# Altium schematic sheet Power.SchDoc
size A; SheetNumber: 1; SheetTotal: 3
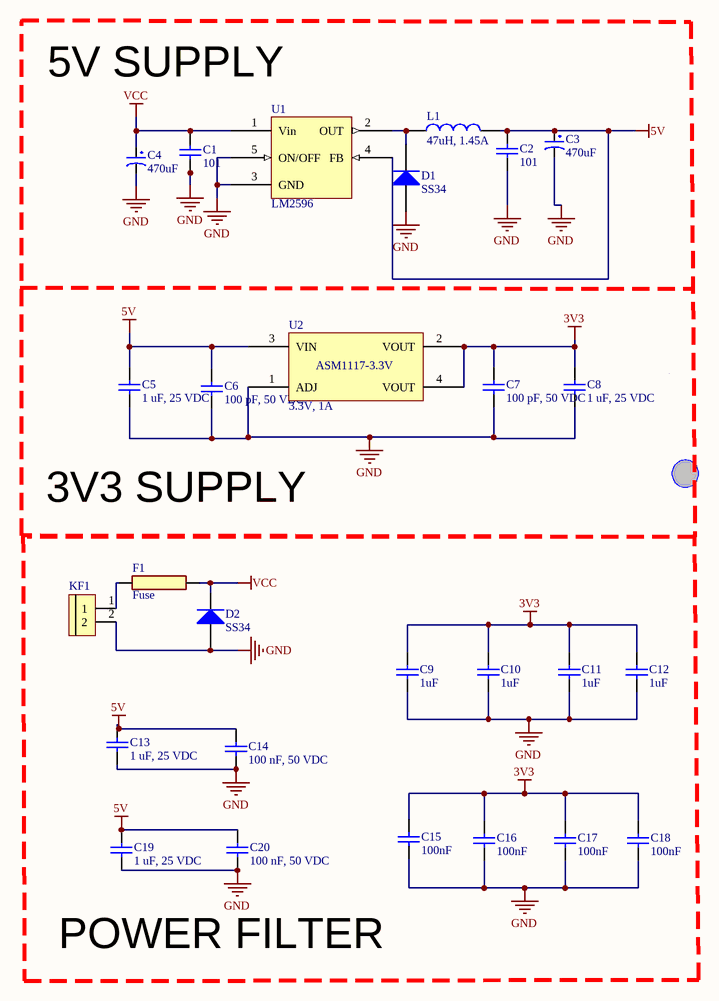
[diagram p0: Power.SchDoc]

## Parts
C1  101  [tu 0805]
C2  101  [tu 0805]
C3  470uF  [tu hoa 8mm]
C4  470uF  [tu hoa 8mm]
C5  1 uF, 25 VDC  [CAP_0603]
C6  100 pF, 50 VDC  [CAP_0603]
C7  100 pF, 50 VDC  [CAP_0603]
C8  1 uF, 25 VDC  [CAP_0603]
C9  1uF  [CAP_0805]
C10  1uF  [CAP_0805]
C11  1uF  [CAP_0805]
C12  1uF  [CAP_0805]
C13  1 uF, 25 VDC  [CAP_0805]
C14  100 nF, 50 VDC  [CAP_0805]
C15  100nF  [CAP_0603]
C16  100nF  [CAP_0603]
C17  100nF  [CAP_0603]
C18  100nF  [CAP_0603]
C19  1 uF, 25 VDC  [CAP_0805]
C20  100 nF, 50 VDC  [CAP_0805]
D1  SS34  [DIODE SMA]
D2  SS34  [DIODE SMA]
F1  Fuse  [FUSE]
KF1  CON 2 KF7.62  [CON 2 KF7.62]  (value not drawn)
L1  47uH, 1.45A  [WE-PD2A_1054]
U1  LM2596  [LM2596_Library]
U2  3.3V, 1A  [AMS1117-3.3V SOT223]

## Nets
3V3: C7.2 C8.2 C9.2 C10.2 C11.2 C12.2 C15.2 C16.2 C17.2 C18.2 U2.2(VOUT) U2.4(VOUT)
5V: C2.1 C3.1 C5.2 C6.2 C13.2 C14.2 C19.2 C20.2 L1.2 U1.4(FB) U2.3(VIN)
GND: C1.2 C2.2 C3.2 C4.2 C5.1 C6.1 C7.1 C8.1 C9.1 C10.1 C11.1 C12.1 C13.1 C14.1 C15.1 C16.1 C17.1 C18.1 C19.1 C20.1 D1.1(A) D2.1(A) KF1.2 U1.3(GND) U1.5(ON/OFF) U2.1(ADJ)
VCC: C1.1 C4.1 D2.2(K) F1.51 U1.1(Vin)
NetD1_2: D1.2(K) L1.1 U1.2(OUT)
NetF1_?1: F1.?1(FUSE) KF1.1

## Notes on the sheet
- 5V SUPPLY
- 3V3 SUPPLY
- POWER FILTER
- (in symbol AMS1117-3.3V) ASM1117-3.3V

## Library data of the parts
C1 C2 = Tu 0805 101 50V 20%: Dán; Don_Vi: Con; So_Chan: 2; Ten_Linh_Kien: Tụ 0805 101-0.1nF 50V 20%; Ma_Hang: MH002806; Chung_Loai: Dán; Kieu_Chan: *
C3 C4 = Tu Hoa 470uF 25V 8x13: Cắm; Don_Vi: Con; So_Chan: 2; Ten_Linh_Kien: Tụ Hóa 470uF 25V; Ma_Hang: MH 470uF 25V; Chung_Loai: Cắm; Kieu_Chan: *
C5 C8 = 0106031051025: CAP, size 0603, 1 uF, 25 VDC; Manufacture Name: Samsung Electro-Mechanics; Manufacture SN: CL10A105KA8NNNC; Capacitance: 1 uF; Tolerance: +/-10%; Voltage Rating DC: 25 VDC; ComponentLink2Description: Datasheet; ComponentLink2URL: https://www.mouser.vn/datasheet/2/585/MLCC-1837944.pdf; Operating Temperature: -55 to +125degC; Packaging: Tape and Reel; Mounting Technology: SMT; Size: 0603; Supplier 1 Name: Mouser; Supplier 1 SN: 187-CL10A105KA8NNNC; Supplier 1 URL: https://www.mouser.vn/ProductDetail/Samsung-Electro-Mechanics/CL10A105KA8NNNC?qs=hqM3L16%252BxldY%252BnK4KzDJVg%3D%3D&utm_source=mouser-refine-download&utm_medium=file&utm_campaign=CL10A105KA8NNNC&utm_content=Samsung-Electro-Mechanics; Supplier 2 Name: Digi-Key; Supplier 2 SN: 1276-1102-2-ND; Supplier 2 URL: https://www.digikey.com/en/products/detail/samsung-electro-mechanics/cl10a105ka8nnnc/3886760; Supplier 3 Name: thegioiic; Supplier 3 SN: N/A; Supplier 3 URL: N/A; Value: 1 uF, 25 VDC
C6 C7 = 0106031010550: CAP, size 0603, 100 pF, 50 VDC; Manufacture Name: TDK; Manufacture SN: CGA3E2C0G1H101J080AA; Capacitance: 100 pF; Tolerance: +/-5%; Voltage Rating DC: 50 VDC; ComponentLink2Description: Datasheet; ComponentLink2URL: https://product.tdk.com/system/files/dam/doc/product/capacitor/ceramic/mlcc/catalog/mlcc_automotive_general_en.pdf?ref_disty=mouser; Operating Temperature: -55 to +125degC; Packaging: Tape and Reel; Mounting Technology: SMT; Size: 0603; Supplier 1 Name: Mouser; Supplier 1 SN: 810-CGA3E2C0G1H101J; Supplier 1 URL: https://www.mouser.com/ProductDetail/TDK/CGA3E2C0G1H101J080AA?qs=FxQuwy19cyBF0gUakpLdHA%3D%3D&utm_source=mouser-refine-download&utm_medium=file&utm_campaign=CGA3E2C0G1H101J080AA&utm_content=TDK; Supplier 2 Name: Digi-Key; Supplier 2 SN: 445-5640-2-ND; Supplier 2 URL: https://www.digikey.com/en/products/detail/tdk-corporation/cga3e2c0g1h101j080aa/2443118; Supplier 3 Name: thegioiic; Supplier 3 SN: N/A; Supplier 3 URL: N/A; Value: 100 pF, 50 VDC
C9-C12 = 0108051051025: CAP, size 0805, 1 uF, 25 VDC; Manufacture Name: TDK; Manufacture SN: CGA4J1X8R1E105K125AE; Tolerance: +/-10%; Voltage Rating DC: 25 VDC; ComponentLink2Description: Datasheet; ComponentLink2URL: https://product.tdk.com/system/files/dam/doc/product/capacitor/ceramic/mlcc/catalog/mlcc_automotive_soft_en.pdf?ref_disty=mouser; Operating Temperature: -55 to +125degC; Packaging: Tape and Reel; Mounting Technology: SMT; Size: 0805; Capacitance: 1 uF; Supplier 1 Name: Mouser; Supplier 1 SN: 810-A4J1X815K125AE; Supplier 1 URL: https://www.mouser.vn/ProductDetail/TDK/CGA4J1X8R1E105K125AE?qs=Ii670aiJhr6VRhkBsruYJg%3D%3D&utm_source=mouser-refine-download&utm_medium=file&utm_campaign=CGA4J1X8R1E105K125AE&utm_content=TDK; Supplier 2 Name: Digi-Key; Supplier 2 SN: 445-174807-2-ND; Supplier 2 URL: https://www.digikey.com/en/products/detail/tdk-corporation/cga4j1x8r1e105k125ae/6556490; Supplier 3 Name: thegioiic; Supplier 3 SN: OEM; Supplier 3 URL: N/A; Value: 1 uF, 25 VDC
C13 C19 = 0108051051025: CAP, size 0805, 1 uF, 25 VDC; Manufacture Name: TDK; Manufacture SN: CGA4J1X8R1E105K125AE; Capacitance: 1 uF; Tolerance: +/-10%; Voltage Rating DC: 25 VDC; ComponentLink2Description: Datasheet; ComponentLink2URL: https://product.tdk.com/system/files/dam/doc/product/capacitor/ceramic/mlcc/catalog/mlcc_automotive_soft_en.pdf?ref_disty=mouser; Operating Temperature: -55 to +125degC; Packaging: Tape and Reel; Mounting Technology: SMT; Size: 0805; Supplier 1 Name: Mouser; Supplier 1 SN: 810-A4J1X815K125AE; Supplier 1 URL: https://www.mouser.vn/ProductDetail/TDK/CGA4J1X8R1E105K125AE?qs=Ii670aiJhr6VRhkBsruYJg%3D%3D&utm_source=mouser-refine-download&utm_medium=file&utm_campaign=CGA4J1X8R1E105K125AE&utm_content=TDK; Supplier 2 Name: Digi-Key; Supplier 2 SN: 445-174807-2-ND; Supplier 2 URL: https://www.digikey.com/en/products/detail/tdk-corporation/cga4j1x8r1e105k125ae/6556490; Supplier 3 Name: thegioiic; Supplier 3 SN: OEM; Supplier 3 URL: N/A; Value: 1 uF, 25 VDC
C14 C20 = 0108051041050: CAP, size 0805, 100 nF, 50 VDC; Manufacture Name: TDK; Manufacture SN: CGA4J2X8R1H104K125AD; Capacitance: 0.1 nF; Tolerance: +/-10%; Voltage Rating DC: 50 VDC; Value: 0.1 nF, 50 VDC; ComponentLink2Description: Datasheet; ComponentLink2URL: https://product.tdk.com/system/files/dam/doc/product/capacitor/ceramic/mlcc/catalog/mlcc_automotive_epoxy_en.pdf?ref_disty=mouser; Operating Temperature: -55 to +125degC; Packaging: Tape and Reel; Mounting Technology: SMT; Size: 0805; Supplier 1 Name: Mouser; Supplier 1 SN: 810-C2012X8R1H104KEP; Supplier 1 URL: https://www.mouser.vn/ProductDetail/TDK/CGA4J2X8R1H104K125AD?qs=LcTL%2F5vFEzExqZqv3rh1qQ%3D%3D&utm_source=mouser-refine-download&utm_medium=file&utm_campaign=CGA4J2X8R1H104K125AD&utm_content=TDK; Supplier 2 Name: Digi-Key; Supplier 2 SN: 445-8810-2-ND; Supplier 2 URL: https://www.digikey.com/en/products/detail/tdk-corporation/cga4j2x8r1h104k125ad/3248169; Supplier 3 Name: thegioiic; Supplier 3 SN: OEM; Supplier 3 URL: N/A
C15-C18 = 0106031041050: CAP, size 0603, 100 nF, 50 VDC; Manufacture Name: TDK; Manufacture SN: CGA3E3X8R1H104K080AE; Tolerance: +/-10%; Voltage Rating DC: 50 VDC; ComponentLink2Description: Datasheet; ComponentLink2URL: https://product.tdk.com/system/files/dam/doc/product/capacitor/ceramic/mlcc/catalog/mlcc_automotive_soft_en.pdf?ref_disty=mouser; Operating Temperature: -55 to +125degC; Packaging: Tape and Reel; Mounting Technology: SMT; Size: 0603; Capacitance: 100 nF; Supplier 1 Name: Mouser; Supplier 1 SN: 810-CGA3E3X8R1H104KA; Supplier 1 URL: https://www.mouser.com/ProductDetail/TDK/CGA3E3X8R1H104K080AE?qs=nQSIdc08i%252Bd8g3IRRgU2bw%3D%3D&utm_source=mouser-refine-download&utm_medium=file&utm_campaign=CGA3E3X8R1H104K080AE&utm_content=TDK; Supplier 2 Name: Digi-Key; Supplier 2 SN: 445-173697-2-ND; Supplier 2 URL: https://www.digikey.com/en/products/detail/tdk-corporation/cga3e3x8r1h104k080ae/5809262; Supplier 3 Name: thegioiic; Supplier 3 SN: N/A; Supplier 3 URL: N/A; Value: 100 nF, 50 VDC
D1 D2 = Diode SS34 ( 1N5822 ): Dán; Don_Vi: Con; Ma_Hang: MH002104; Ten_Linh_Kien: Diode SS34 3A 40V SMA ( 1N5822 SS34A); Kieu_Chan: *; Chung_Loai: Dán
KF1 = CON 2 KF7.62: Cắm; Ma_Hang: MH002053; Ten_Linh_Kien: CON 2 KF7.62-2P 7.62MM (Đen Thẳng); Chung_Loai: Cắm; Ghi_Chu: *; Kieu_Chan: *; Don_Vi: Con
L1 = 784776147: WE-PD2A SMT Power Inductor, size 1054, 47uH, 1.45A; Manufacturer: Wurth Elektronik; DC Resistance max.: 0.17Ohm; Saturation Current: 1.62A; Self Resonant Frequency: 9.77MHz; DC Resistance typ.: 0.095Ohm; Rated Voltage: 80VDC; Supply 3 Name: thegioiic; ComponentLink1Description: Manufacturer; ComponentLink1URL: http://www.we-online.de; ComponentLink2Description: Datasheet; ComponentLink2URL: https://www.we-online.com/catalog/datasheet/784776147.pdf; Manufacturer Part Number: 784776147; Published Date: May 2020; Rated Current: 1.45A; Inductance: 47uH; Operating Temperature: -40 to +125degC; Mounting Technology: SMT; Packaging: Tape and Reel; Size: 1054; Supplier 2 Name: Digi-Key; Supplier 2 SN: 732-6889-2-ND; Supplier 1 URL: https://www.digikey.com/en/products/detail/w%C3%BCrth-elektronik/784776147/5168920?s=N4IgTCBcDaIOwA4Asc4DYCMKQF0C%2BQA; Supplier 1 Name: Mouser; Supplier 1 SN: 710-784776147; Supplier 1 URL: https://www.mouser.vn/ProductDetail/Wurth-Elektronik/784776147?qs=sBf%2Fb4nBSle0C%2Fv6Vt57Vw%3D%3D; Supply 3 SN: N/A; Supply 3 URL: https://www.thegioiic.com/cdrh104-cuon-cam-dan-smd-1038-470-47uh-2-44a; Value: 47uH, 1.45A
U2 = AMS1117-3.3V: AMS1117-3.3V, OUT 3.3V 1A.; Manufacturer: AMS; Pad Count: 4; Voltage Input Maximum: 15V; Manufacturer Part Number: N/A; Current Input Maximum: N/A; Current Output Maximum: 1A; Supplier 1 Name: Mouser; Supplier 2 Name: Digi-Key; Supplier 3 Name: thegioiic; Voltage Output: 3.3V; Mounting Technology: SMD; ComponentLink1Description: Datasheet link; ComponentLink1URL: http://www.advanced-monolithic.com/pdf/ds1117.pdf; ComponentLink2Description: Supplier 1 URL; ComponentLink2URL: N/A; ComponentLink3Description: Supplier 2 URL; ComponentLink3URL: N/A; ComponentLink4Description: Supplier 3 URL; ComponentLink4URL: N/A; Supplier 1 SN: N/A; Supplier 1 URL: N/A; Supplier 2 SN: N/A; Supplier 2 URL: N/A; Supplier 3 SN: N/A; Supplier 3 URL: https://www.thegioiic.com/ams1117-3-3v-ic-on-ap-3-3v-1a-sot-223; Value: 3.3V, 1A